# EAGLE design RN4020_BLE (EAGLE 7.5.0)
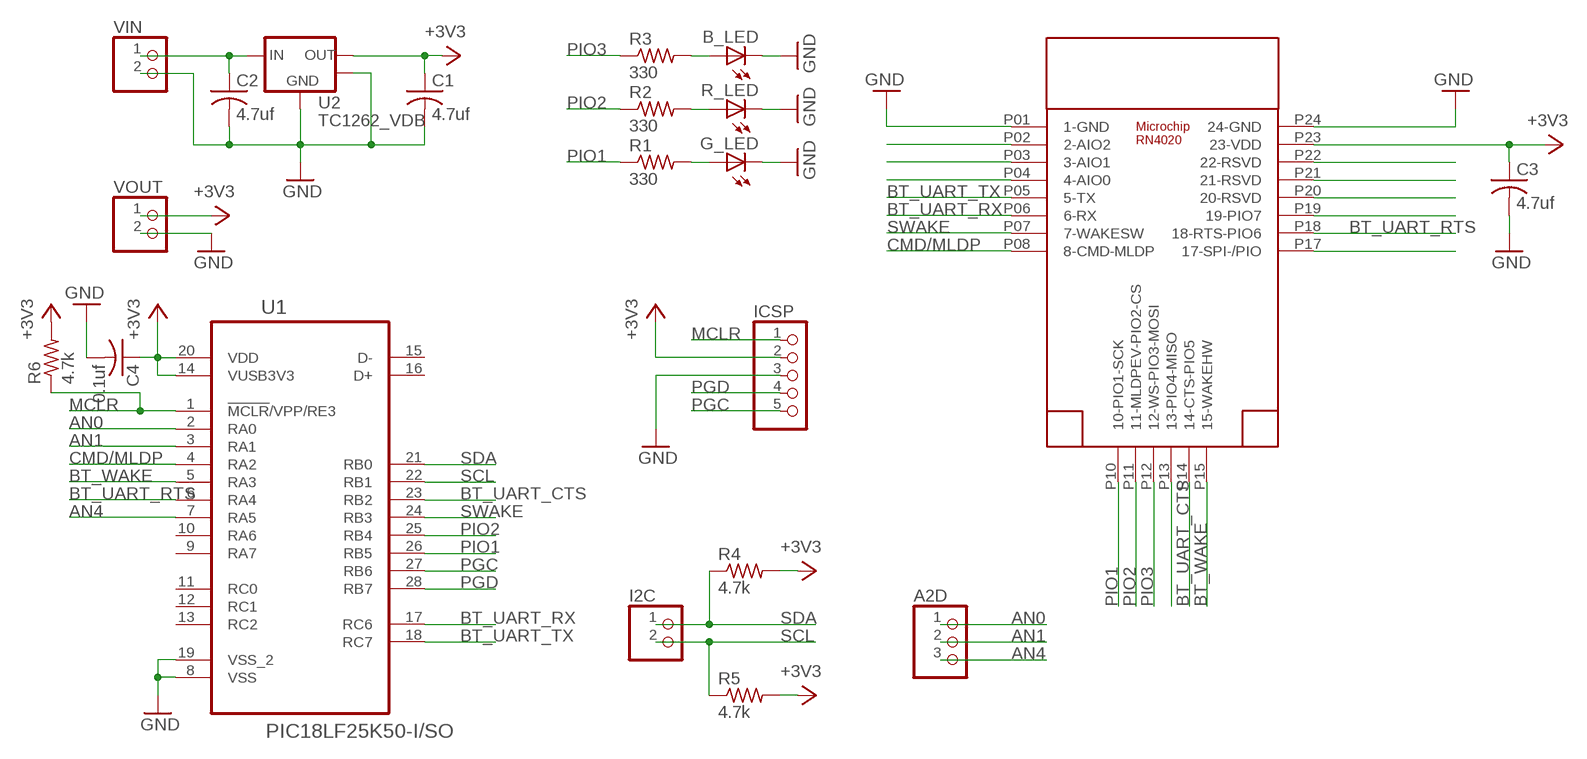
[diagram p0: schematic, sheet 1]

## Parts
A2D  PINHD-1X3  [1X03]
B_LED  LEDSMT1206  [1206]
C1  4.7uf  C-USC1206  [C1206]
C2  4.7uf  C-USC1206  [C1206]
C3  4.7uf  C-USC1206  [C1206]
C4  0.1uf  C-USC1206  [C1206]
G_LED  LEDSMT1206  [1206]
I2C  PINHD-1X2  [1X02]
ICSP  PINHD-1X5  [1X05]
R1  330  R-US_R1206  [R1206]
R2  330  R-US_R1206  [R1206]
R3  330  R-US_R1206  [R1206]
R4  4.7k  R-US_R1206  [R1206]
R5  4.7k  R-US_R1206  [R1206]
R6  4.7k  R-US_R1206  [R1206]
R_LED  LEDSMT1206  [1206]
U1  PIC18LF25K50-I/SO  [SOIC127P1032X265-28N]
U2  TC1262_VDB  [SOT-223-3]
U$1  RN4020  [RN4020SMD]
VIN  PINHD-1X2  [1X02]
VOUT  PINHD-1X2  [1X02]

## Nets
+3V3: C1.1 C3.1 C4.1 ICSP.2 R4.2 R5.2 R6.2 U1.14(VUSB3V3) U1.20(VDD) U2.3(VOUT) U$1.P23(23-VDD) VOUT.1
AN0: A2D.1 U1.2(RA0)
AN1: A2D.2 U1.3(RA1)
AN4: A2D.3 U1.7(RA5)
BT_UART_CTS: U1.23(RB2) U$1.P14(14-CTS-PIO5)
BT_UART_RTS: U1.6(RA4) U$1.P18(18-RTS-PIO6)
BT_UART_RX: U1.17(RC6) U$1.P06(6-RX)
BT_UART_TX: U1.18(RC7) U$1.P05(5-TX)
BT_WAKE: U1.5(RA3) U$1.P15(15-WAKEHW)
CMD/MLDP: U1.4(RA2) U$1.P08(8-CMD-MLDP)
GND: B_LED.C C1.2 C2.2 C3.2 C4.2 G_LED.C ICSP.3 R_LED.C U1.8(VSS) U1.19(VSS_2) U2.2(GND) U2.4(TAB) U$1.P01(1-GND) U$1.P24(24-GND) VIN.2 VOUT.2
MCLR: ICSP.1 R6.1 U1.1(!MCLR!/VPP/RE3)
N$1: G_LED.A R1.2
N$2: R2.2 R_LED.A
N$3: B_LED.A R3.2
N$4: C2.1 U2.1(VIN) VIN.1
N$6: U$1.P02(2-AIO2)
N$7: U$1.P03(3-AIO1)
N$8: U$1.P04(4-AIO0)
N$12: U$1.P13(13-PIO4-MISO)
N$13: U$1.P17(17-SPI-/PIO)
N$14: U$1.P19(19-PIO7)
N$15: U$1.P20(20-RSVD)
N$16: U$1.P21(21-RSVD)
N$17: U$1.P22(22-RSVD)
PGC: ICSP.5 U1.27(RB6)
PGD: ICSP.4 U1.28(RB7)
PIO1: R1.1 U1.26(RB5) U$1.P10(10-PIO1-SCK)
PIO2: R2.1 U1.25(RB4) U$1.P11(11-MLDPEV-PIO2-CS)
PIO3: R3.1 U$1.P12(12-WS-PIO3-MOSI)
SCL: I2C.2 R5.1 U1.22(RB1)
SDA: I2C.1 R4.1 U1.21(RB0)
SWAKE: U1.24(RB3) U$1.P07(7-WAKESW)
Unconnected: U1.9(RA7) U1.10(RA6) U1.11(RC0) U1.12(RC1) U1.13(RC2) U1.15(D-) U1.16(D+)

## Library data of the parts
A2D = pinhead:PINHD-1X3: PIN HEADER
B_LED G_LED R_LED = led:LED: LED OSRAM: - CHIPLED LG R971, LG N971, LY N971, LG Q971, LY Q971, LO R971, LY R971 LH N974, LH R974 LS Q976, LO Q976, LY Q976 LO Q996 - Hyper CHIPLED LW Q18S LB Q993, LB Q99A, LB R99A - SideLED LS A670, LO A670, LY A670, LG A670, LP A670 LB A673, LV A673, LT A673, LW A673 LH A674 LY A675 LS A676, LA A676, LO A676, LY A676, LW A676 LS A679, LY A679, LG A679 - Hyper Micro SIDELED® LS Y876, LA Y876, LO Y876, LY Y876 LT Y87S - SmartLED LW L88C, LW L88S LB L89C, LB L89S, LG L890 LS L89K, LO L89K, LY L89K LS L896, LA L896, LO L896, LY L896 - TOPLED LS T670, LO T670, LY T670, LG T670, LP T670 LSG T670, LSP T670, LSY T670, LOP T670, LYG T670 LG T671, LOG T671, LSG T671 LB T673, LV T673, LT T673, LW T673 LH T674 LS T676, LA T676, LO T676, LY T676, LB T676, LH T676, LSB T676, LW T676 LB T67C, LV T67C, LT T67C, LS T67K, LO T67K, LY T67K, LW E67C LS E67B, LA E67B, LO E67B, LY E67B, LB E67C, LV E67C, LT E67C LW T67C LS T679, LY T679, LG T679 LS T770, LO T770, LY T770, LG T770, LP T770 LB T773, LV T773, LT T773, LW T773 LH T774 LS E675, LA E675, LY E675, LS T675 LS T776, LA T776, LO T776, LY T776, LB T776 LHGB T686 LT T68C, LB T68C - Hyper Mini TOPLED® LB M676 - Mini TOPLED Santana® LG M470 LS M47K, LO M47K, LY M47K Source: http://www.osram.convergy.de LUXEON: - LUMILED® LXK2-PW12-R00, LXK2-PW12-S00, LXK2-PW14-U00, LXK2-PW14-V00 LXK2-PM12-R00, LXK2-PM12-S00, LXK2-PM14-U00 LXK2-PE12-Q00, LXK2-PE12-R00, LXK2-PE12-S00, LXK2-PE14-T00, LXK2-PE14-U00 LXK2-PB12-K00, LXK2-PB12-L00, LXK2-PB12-M00, LXK2-PB14-N00, LXK2-PB14-P00, LXK2-PB14-Q00 LXK2-PR12-L00, LXK2-PR12-M00, LXK2-PR14-Q00, LXK2-PR14-R00 LXK2-PD12-Q00, LXK2-PD12-R00, LXK2-PD12-S00 LXK2-PH12-R00, LXK2-PH12-S00 LXK2-PL12-P00, LXK2-PL12-Q00, LXK2-PL12-R00 Source: www.luxeon.com KINGBRIGHT: KA-3528ASYC Source: www.kingbright.com
C1-C4 = resistor:C-US: CAPACITOR, American symbol
I2C VIN VOUT = pinhead:PINHD-1X2: PIN HEADER
ICSP = pinhead:PINHD-1X5: PIN HEADER
R1-R6 = resistor:R-US_: RESISTOR, American symbol
U1 = mcmurrough:PIC18LF25K50-I/SO: IC, MCU, 8BIT, 32KB FLASH, 28SOIC; MPN: PIC18LF25K50-I/SO; OC_FARNELL: 2305843; OC_NEWARK: 06W3032; PACKAGE: 28SOIC; SUPPLIER: Microchip
U2 = bt_regulator:TC1262: Microchip TC1262 LDO Regulator The TC1262 is a fixed output, high accuracy (typically ±0.5%) CMOS low dropout regulator. Designed specif- ically for battery-operated systems, the TC1262’s CMOS construction eliminates wasted ground current, significantly extending battery life. Total supply current is typically 80A at full load (20 to 60 times lower than in bipolar regulators). TC1262 key features include ultra low noise operation, very low dropout voltage (typically 350mV at full load), and fast response to step changes in load. Datasheet.pdf <http://ww1.microchip.com/downloads/en/DeviceDoc/21373C.pdf>
U$1 = microchip_bluetooth_v101:RN4020

## Board
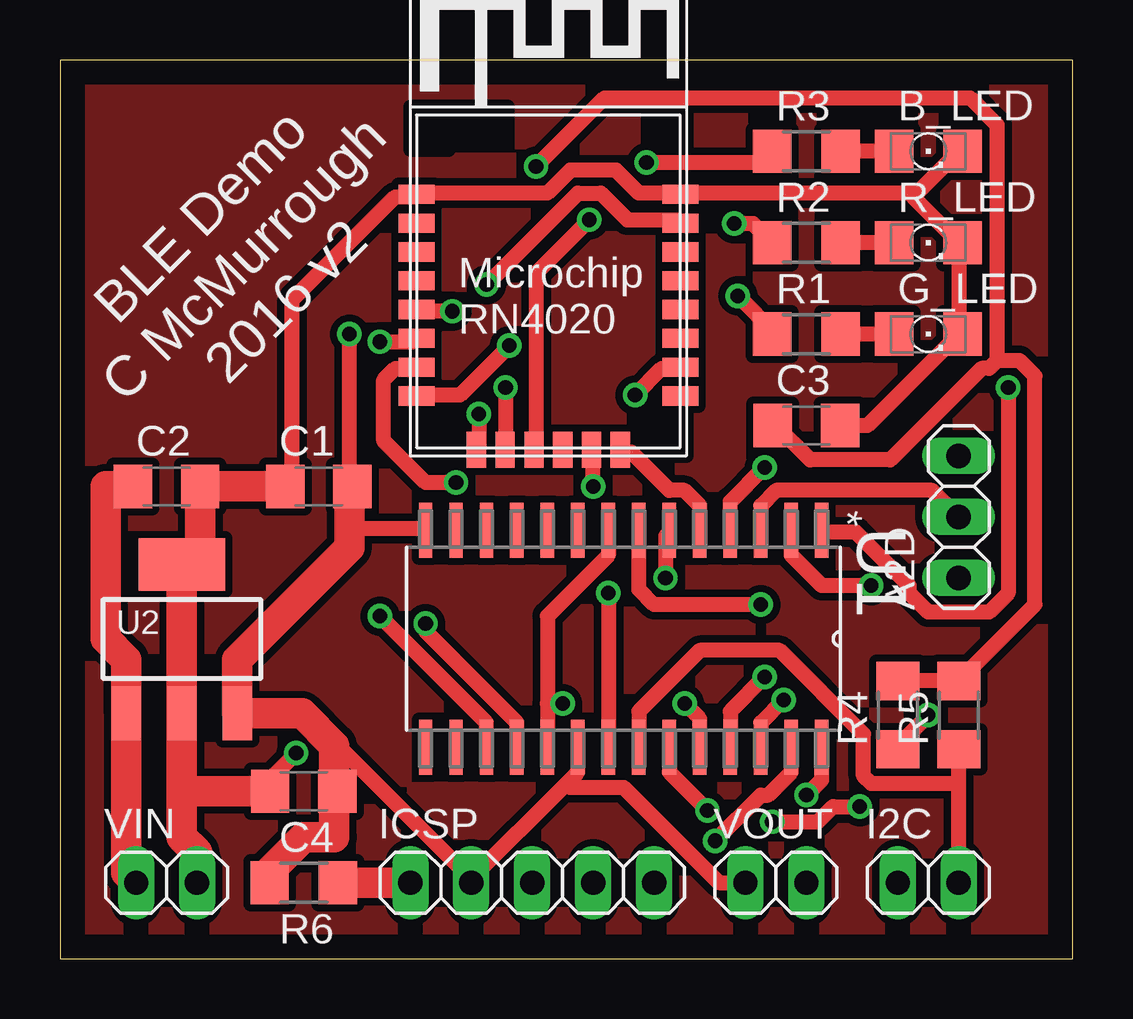
[diagram p1: board, top side]
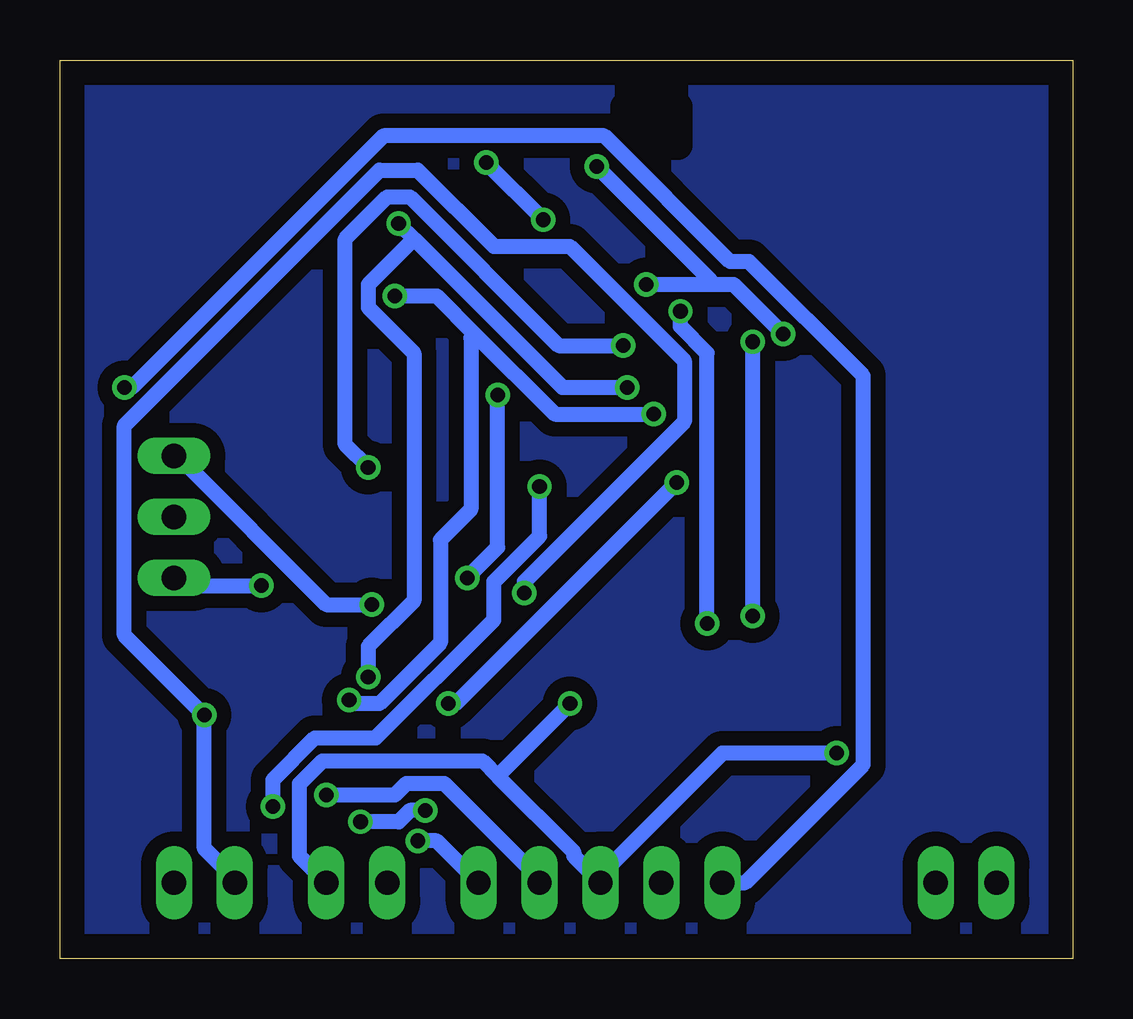
[diagram p2: board, bottom side, seen from below]

Size 42.22 x 37.45 mm. Coordinates in mm from the lower left corner, seen from the top.
Outline: 0,0 42.22,0 42.22,37.45 0,37.45 0,0
Copper layers (1*16): Top 0.035mm / dielectric 1.5mm / Bottom 0.035mm
Design rules "default *": minimum track width 25mil, minimum drill 24mil, track to track 8mil, track to pad 8mil, pad to pad 8mil, via to via 8mil, smd to smd 8mil, copper to edge 40mil, drill to drill 8mil, minimum pad ring 10mil, minimum via ring 8mil, stop-mask expansion 4mil, vias tented up to drill 0mil, thermal gap 10mil

### Footprints (pad centres in the part's own frame; a part is rotated, then mirrored left to right if it is on the bottom)
1X03 = drill 1.016 long: 1 -2.54,0; 2 0,0; 3 2.54,0
1206 = smd 1.6 x 1.803: A -1.422,0; C 1.422,0
C1206 = smd 1.6 x 1.8: 1 -1.4,0; 2 1.4,0
1X02 = drill 1.016 long: 1 -1.27,0; 2 1.27,0
1X05 = drill 1.016 long: 1 -5.08,0; 2 -2.54,0; 3 0,0; 4 2.54,0; 5 5.08,0
R1206 = smd 1.6 x 1.803: 1 -1.422,0; 2 1.422,0
SOIC127P1032X265-28N = smd 2.286 x 0.559: 1 -4.521,8.255; 2 -4.521,6.985; 3 -4.521,5.715; 4 -4.521,4.445; 5 -4.521,3.175; 6 -4.521,1.905; 7 -4.521,0.635; 8 -4.521,-0.635; 9 -4.521,-1.905; 10 -4.521,-3.175; 11 -4.521,-4.445; 12 -4.521,-5.715; 13 -4.521,-6.985; 14 -4.521,-8.255; 15 4.521,-8.255; 16 4.521,-6.985; 17 4.521,-5.715; 18 4.521,-4.445; 19 4.521,-3.175; 20 4.521,-1.905; 21 4.521,-0.635; 22 4.521,0.635; 23 4.521,1.905; 24 4.521,3.175; 25 4.521,4.445; 26 4.521,5.715; 27 4.521,6.985; 28 4.521,8.255
SOT-223-3 = smd 1.219 x 2.235: 1 -2.311,-3.099; 2 0,-3.099; 3 2.311,-3.099 | smd 3.6 x 2.2: 4 0,3.099
RN4020SMD = smd 1.5 x 0.8: P01 0.25,10.9; P02 0.25,9.7; P03 0.25,8.5; P04 0.25,7.3; P05 0.25,6.1; P06 0.25,4.9; P07 0.25,3.7; P08 0.25,2.5; P17 11.25,2.5; P18 11.25,3.7; P19 11.25,4.9; P20 11.25,6.1; P21 11.25,7.3; P22 11.25,8.5; P23 11.25,9.7; P24 11.25,10.9 | smd 0.8 x 1.5: P10 2.75,0.25; P11 3.95,0.25; P12 5.15,0.25; P13 6.35,0.25; P14 7.55,0.25; P15 8.75,0.25

### Placement (x,y rotation side)
A2D  37.47,18.42 90 top
B_LED  36.2,33.66 0 top
C1  10.79,19.69 180 top
C2  4.45,19.69 0 top
C3  31.12,22.23 0 top
C4  10.16,6.99 180 top
G_LED  36.2,26.04 0 top
I2C  36.2,3.17 0 top
ICSP  19.69,3.17 0 top
R1  31.12,26.04 0 top
R2  31.12,29.85 0 top
R3  31.12,33.66 0 top
R4  34.93,10.16 90 top
R5  37.47,10.16 90 top
R6  10.16,3.17 180 top
R_LED  36.2,29.85 0 top
U1  23.5,13.33 270 top
U2  5.08,13.33 0 top
U$1  14.6,20.96 0 top
VIN  4.45,3.17 0 top
VOUT  29.85,3.17 0 top

### Tracks (layer width: path | path; a pad name or v marks a point on that pad's centre or on a via)
+3V3  (via drill 0.61)
  Top 0.635: 39.05,24.92 38.73,24.61 38.42,24.61 34.61,20.8 31.27,20.8 29.85,22.23 C3.1 | 39.05,24.92 40.01,24.92 40.64,24.29 40.64,14.76 R5.2 37.31,11.59 R4.2 | U1.20 21.59,7.78 21.11,7.3 | 21.11,7.3 17.14,3.33 ICSP.2 16.99,3.49 11.91,8.57 11.43,8.57 | VOUT.1 27.46,3.17 23.5,7.14 21.27,7.14 21.11,7.3 | v17.78,28.1 21.59,31.91 22.54,31.91 23.65,30.8 25.72,30.8 U$1.P23 | v12.06,26.04 12.06,20.16 C1.1 | 12.06,17.94 15.24,17.94 U1.14 | 39.05,24.92 39.05,34.77 37.94,35.88 22.7,35.88 v19.84,33.02
  Top 1.27: C1.1 12.06,19.55 12.06,17.94 12.06,17.14 7.39,12.47 U2.3 10.08,10.24 11.43,8.89 11.43,8.57 11.43,7.12 C4.1 11.43,6.86 11.43,5.08 10.16,5.08 8.74,3.66 R6.2
  Bottom 0.635: 15.08,28.1 14.13,28.1 v12.06,26.04 | 15.08,28.1 v17.78,28.1 | v19.84,33.02 15.08,28.26 15.08,28.1
AN0  (via drill 0.61)
  Top 0.635: U1.2 30.48,16.83 31.75,15.56 v33.81,15.56
  Bottom 0.635: v33.81,15.56 37.15,15.56 A2D.1
AN1
  Top 0.635: U1.3 29.21,18.89 29.85,19.53 36.35,19.53 A2D.2
AN4  (via drill 0.61)
  Top 0.635: U1.7 24.13,15.4 24.77,14.76 v29.21,14.76
  Bottom 0.635: v29.21,14.76 31.12,14.76 37.31,20.96 A2D.3
BT_UART_CTS  (via drill 0.61)
  Top 0.635: v22.23,19.69 22.23,21.11 U$1.P14 | v33.34,6.35 32.23,6.35 31.59,5.71 v29.69,5.71 | v26.99,6.19 25.4,7.78 U1.23
  Bottom 0.635: v22.23,19.69 22.23,17.62 24.13,15.72 24.13,14.13 29.05,9.21 31.59,9.21 33.34,7.46 v33.34,6.35 | v29.69,5.71 28.1,5.71 27.62,6.19 v26.99,6.19
BT_UART_RTS  (via drill 0.61)
  Top 0.635: v23.97,23.5 25.08,24.61 25.72,24.61 U$1.P18 | v25.24,15.88 25.24,17.62 25.4,17.78 U1.6
  Bottom 0.635: v23.97,23.5 23.97,17.14 v25.24,15.88
BT_UART_RX  (via drill 0.61)
  Top 0.635: v13.33,25.72 14.76,25.72 U$1.P06 | v13.33,14.29 17.78,9.84 U1.17
  Bottom 0.635: v13.33,14.29 v13.33,25.72
BT_UART_TX  (via drill 0.61)
  Top 0.635: v16.35,26.99 14.92,26.99 U$1.P05 | v15.24,13.97 15.24,13.65 19.05,9.84 U1.18
  Bottom 0.635: v16.35,26.99 16.35,26.35 15.24,25.24 v15.24,13.97
BT_WAKE
  Top 0.635: U1.5 26.67,18.89 26.04,19.53 25.4,19.53 23.81,21.11 23.5,21.11 U$1.P15
CMD/MLDP  (via drill 0.61)
  Top 0.635: v18.73,25.56 16.67,23.5 14.92,23.5 U$1.P08 | v29.37,20.48 27.94,19.05 U1.4
  Bottom 0.635: v18.73,25.56 21.43,25.56 27.62,31.75 28.58,31.75 30.32,30 30.32,21.43 v29.37,20.48
GND  (via drill 0.61)
  Top 0.635: 20.32,10.64 20.32,14.29 22.86,16.83 U1.8 | 20.32,10.64 U1.19 | v20.96,10.64 20.32,10.64 | C1.2 9.68,20.16 9.68,27.46 13.97,31.75 14.76,31.75 U$1.P01 15.08,31.91 20.32,31.91 21.27,32.86 23.18,32.86 24.13,31.91 25.56,31.91 U$1.P24 25.88,31.91 35.56,31.91 | C3.2 33.66,22.23 37.47,26.04 G_LED.C 37.47,26.19 37.47,29.69 R_LED.C 37.47,29.85 35.56,31.75 35.56,31.91 | 35.56,31.91 35.72,31.91 37.47,33.66 B_LED.C | v9.84,8.57 8.73,7.46 C4.2
  Top 1.27: 5.08,6.99 U2.2 U2.4 5.84,17.2 C2.2 C1.2 | 5.08,6.99 5.08,5.08 5.71,4.45 VIN.2 | C4.2 5.08,6.99
  Bottom 0.635: 23.97,7.62 24.61,8.25 31.27,8.25 32.23,7.3 32.23,4.29 VOUT.2 | 23.97,7.62 20.8,4.45 20.8,4.29 ICSP.3 19.69,3.49 14.6,8.57 v9.84,8.57 | 23.97,7.62 v20.96,10.64
MCLR  (via drill 0.61)
  Top 0.635: v39.53,23.81 39.53,15.24 38.73,14.45 36.2,14.45 35.4,15.24 35.4,15.56 33.18,17.78 31.75,17.78 U1.1
  Top 1.27: R6.1 ICSP.1
  Bottom 0.635: v39.53,23.81 39.21,23.81 28.73,34.29 19.53,34.29 14.29,29.05 13.49,29.05 8.73,24.29 8.73,8.1 13.65,3.17 ICSP.1
N$1
  Top 0.635: G_LED.A R1.2
N$2
  Top 0.635: R_LED.A R2.2
N$3
  Top 0.635: B_LED.A R3.2
N$4
  Top 1.27: VIN.1 2.77,3.58 U2.1 2.77,12.47 1.91,13.33 1.91,19.69 C2.1
N$5
  pour Bottom (isolate 0.61): 0.64,37.47 42.55,37.47 42.55,0 0,0 0,37.47
N$9
  pour Top (isolate 0.305): 0.64,37.47 42.55,37.47 42.55,0 0,0 0,37.47
PGC  (via drill 0.61)
  Top 0.635: U1.27 30.48,7.78 29.53,6.83 29.21,6.83 v27.3,4.92
  Bottom 0.635: v27.3,4.92 26.51,4.92 ICSP.5
PGD  (via drill 0.61)
  Top 0.635: U1.28 31.75,7.46 v31.12,6.83
  Bottom 0.635: v31.12,6.83 28.26,6.83 27.78,7.3 26.19,7.3 22.23,3.33 ICSP.4
PIO1  (via drill 0.61)
  Top 0.635: v17.46,22.7 17.46,21.27 U$1.P10 | v28.26,27.62 29.85,26.04 R1.1 | U1.26 29.21,9.84 v30.16,10.79
  Bottom 0.635: v17.46,22.7 21.59,22.7 24.92,26.04 | 24.92,26.04 26.51,27.62 v28.26,27.62 | v30.16,10.79 30,10.79 29.85,10.64 28.89,10.64 26.35,13.18 26.35,17.46 25.08,18.73 25.08,25.88 24.92,26.04
PIO2  (via drill 0.61)
  Top 0.635: v18.57,23.81 18.57,21.27 U$1.P11 | v28.1,30.64 28.89,30.64 R2.1 | U1.25 27.94,10.32 v29.37,11.75
  Bottom 0.635: v18.57,23.81 21.27,23.81 27.46,30 | v28.1,30.64 27.46,30 | v29.37,11.75 29.37,13.02 27.46,14.92 27.46,25.24 29.37,27.15 29.37,28.1 27.46,30
PIO3  (via drill 0.61)
  Top 0.635: v22.07,30.8 19.84,28.58 19.84,21.27 U$1.P12 | v24.45,33.18 29.21,33.18 R3.1
  Bottom 0.635: v24.45,33.18 v22.07,30.8
SCL
  Top 0.635: I2C.2 37.47,7.3 | 37.47,7.3 R5.1 | U1.22 24.13,10.32 26.67,12.86 30,12.86 33.5,9.37 33.5,7.62 33.81,7.3 37.47,7.3
SDA  (via drill 0.61)
  Top 0.635: v36.2,10.16 34.93,8.89 R4.1 | v22.86,15.24 U1.21
  Bottom 0.635: I2C.1 34.93,3.33 36.2,4.6 v36.2,10.16 39.53,13.49 39.53,22.23 28.89,32.86 27.3,32.86 24.13,29.69 20.96,29.69 16.19,24.92 16.19,22.38 22.86,15.72 v22.86,15.24
SWAKE  (via drill 0.61)
  Top 0.635: v16.51,19.84 15.24,19.84 13.49,21.59 13.49,24.13 13.97,24.61 14.76,24.61 U$1.P07 | v26.04,10.64 26.67,10 U1.24
  Bottom 0.635: v16.51,19.84 25.72,10.64 v26.04,10.64

### Text on the board
tPlace: BLE Demo / C McMurrough / 2016 v2